# Altium project RASP-HDMI_MUX.PrjPcb
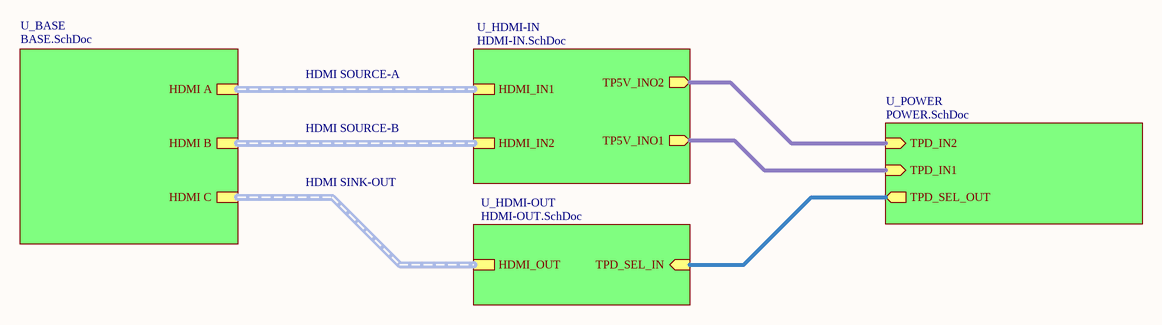
[diagram p0: MAIN.SchDoc]
CAGE_CODE: #; Date: 14.05.2022; DOC_NO_ASSY_DWG: #012022051430; DOC_NO_BOM: #012022051440; DOC_NO_FAB_DWG: #012022051420; DOC_NO_SCH_DWG: #012022051400; DocumentRevision: V1.2; PCB_DWG_NO: #012022051410; Project: HDMI-MUX; ProjectRevision: V1.0; Revision: V1.0
5 sheets, 70 parts. Net scope: hierarchical (ports join the sheet entries above them; power ports are global).
Board file: RASP.PcbDoc
Sheets:
  MAIN.SchDoc
    U_BASE = BASE.SchDoc
    U_HDMI-IN = HDMI-IN.SchDoc
    U_HDMI-OUT = HDMI-OUT.SchDoc
    U_POWER = POWER.SchDoc

## Sheet MAIN.SchDoc: MAIN BLOCK
size A4; Date: 14.06.2022; Revision: V1.0; SheetNumber: 1; SheetTotal: 5; ProjectRevision: V1.0; DOC_NO_SCH_DWG: #012022051400

### Sub-sheets
U_BASE = BASE.SchDoc: HDMI A (harness HDMI A), HDMI B (harness HDMI B), HDMI C (harness HDMI C)
U_HDMI-IN = HDMI-IN.SchDoc: HDMI_IN1 (harness HDMI_IN1), HDMI_IN2 (harness HDMI_IN2), TP5V_INO2 (out), TP5V_INO1 (out)
U_HDMI-OUT = HDMI-OUT.SchDoc: HDMI_OUT (harness HDMI_OUT), TPD_SEL_IN (in)
U_POWER = POWER.SchDoc: TPD_IN2 (in), TPD_IN1 (in), TPD_SEL_OUT (out)

### Nets
TP5V_IN1: sheet U_HDMI-IN/TP5V_INO1, sheet U_POWER/TPD_IN1
TP5V_IN2: sheet U_HDMI-IN/TP5V_INO2, sheet U_POWER/TPD_IN2
NetJH1C_3: sheet U_HDMI-OUT/TPD_SEL_IN, sheet U_POWER/TPD_SEL_OUT

### Buses and harness runs
harness sheet U_BASE/HDMI A = sheet U_HDMI-IN/HDMI_IN1
harness sheet U_BASE/HDMI B = sheet U_HDMI-IN/HDMI_IN2
harness sheet U_BASE/HDMI C = sheet U_HDMI-OUT/HDMI_OUT

### Notes on the sheet
- HDMI SOURCE-A
- HDMI SOURCE-B
- HDMI SINK-OUT
- THIS DOCUMENT AND THE DATA DISCLOSED HEREIN OR
- HEREWITH IS THE PROPERTY OF SPD Ind.
- ENG:
- DHARAGESWARAN S
- APPROVALS
- DATE
- PROJECT
- DSN:
- CHK:
- REFERENCE DOCUMENTS
- PROJECT REVISION:
- TITLE
- DOCUMENT REVISION:
- Email: sdhamuvkl@gmail.com <https://github.com/DhamuVkl>
- BOM:
- FAB DWG:
- PCB DWG:
- ASSY DWG:
- SCALE:
- A4
- SIZE
- CAGE CODE
- FILE NAME
- DWG NO.
- SHEET
- REV
- OF

## Sheet BASE.SchDoc: HDMI-MUX
size A4; SheetNumber: 2; SheetTotal: 5; DOC_NO_SCH_DWG: #012022051401
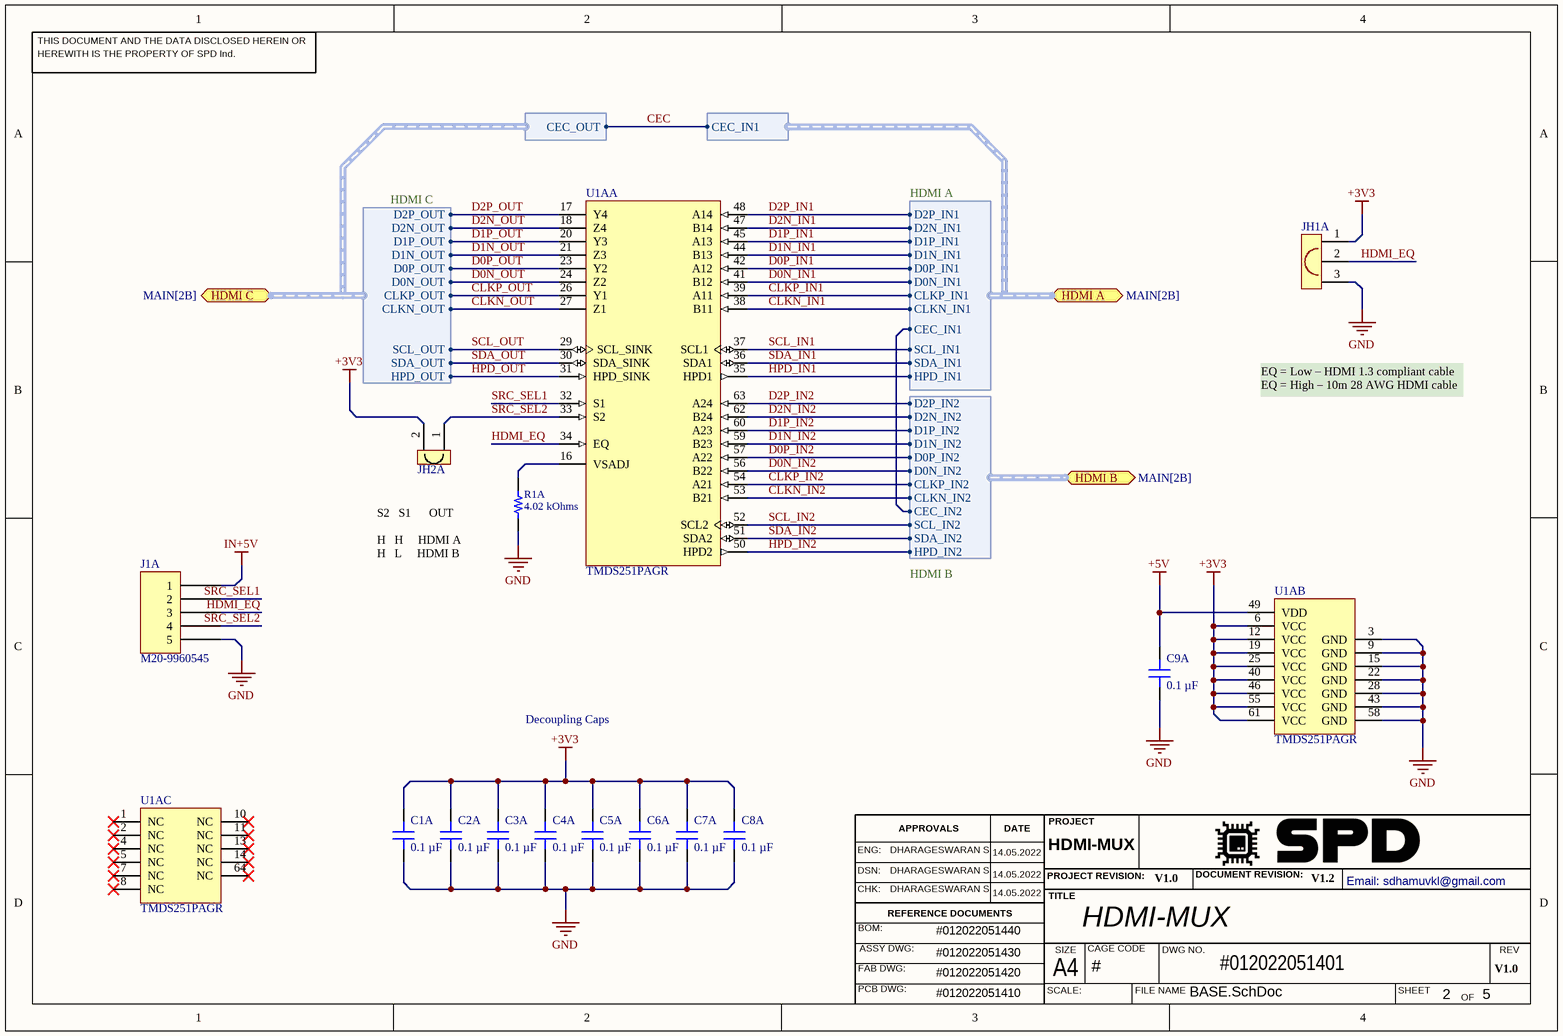
[diagram p1: BASE.SchDoc]

### Parts
C1A  0.1 µF  [CAP 0402_1005]
C2A  0.1 µF  [CAP 0402_1005]
C3A  0.1 µF  [CAP 0402_1005]
C4A  0.1 µF  [CAP 0402_1005]
C5A  0.1 µF  [CAP 0402_1005]
C6A  0.1 µF  [CAP 0402_1005]
C7A  0.1 µF  [CAP 0402_1005]
C8A  0.1 µF  [CAP 0402_1005]
C9A  0.1 µF  [CAP 0402_1005]
J1A  M20-9960545  [HARWIN M20-9960545]
JH1A  3PIN-JUMPER-RED  [JUMPER-3PIN-RED]  (value not drawn)
JH2A  2PIN-JUMPER-BLACK  [JUMPER-2PIN-BLACK]  (value not drawn)
R1A  4.02 kOhms  [RES 0402_1005]
U1A  TMDS251PAGR  [PAG0064A_L]  (parts A,B,C of 3)

### Ports
HDMI A (bidir, harness HDMI A, see MAIN[2B]), HDMI B (bidir, harness HDMI B, see MAIN[2B]), HDMI C (bidir, harness HDMI C, see MAIN[2B])

### Harnesses
HDMI A: D2P_IN1, D2N_IN1, D1P_IN1, D1N_IN1, D0P_IN1, D0N_IN1, CLKP_IN1, CLKN_IN1, SCL_IN1, SDA_IN1, HPD_IN1, CEC_IN1
HDMI B: D2P_IN2, D2N_IN2, D1P_IN2, D1N_IN2, D0P_IN2, D0N_IN2, CLKP_IN2, CLKN_IN2, SCL_IN2, SDA_IN2, HPD_IN2, CEC_IN2
HDMI C: D2P_OUT, D2N_OUT, D1P_OUT, D1N_OUT, D0P_OUT, D0N_OUT, CLKP_OUT, CLKN_OUT, SCL_OUT, SDA_OUT, HPD_OUT
HDMI C1: CEC_OUT
HDMI A1: CEC_IN1

### Nets
+3V3: C1A.2 C2A.2 C3A.2 C4A.2 C5A.2 C6A.2 C7A.2 C8A.2 JH1A.1 JH2A.2 U1A.6(VCC) U1A.12(VCC) U1A.19(VCC) U1A.25(VCC) U1A.40(VCC) U1A.46(VCC) U1A.55(VCC) U1A.61(VCC)
+5V: C9A.2 U1A.49(VDD)  [project net SOURCE]
GND: C1A.1 C2A.1 C3A.1 C4A.1 C5A.1 C6A.1 C7A.1 C8A.1 C9A.1 J1A.5 JH1A.3 R1A.1 U1A.3(GND) U1A.9(GND) U1A.15(GND) U1A.22(GND) U1A.28(GND) U1A.43(GND) U1A.58(GND)
IN+5V: J1A.1
CEC: port HDMI A.CEC_IN1, port HDMI B.CEC_IN2, port HDMI C.CEC_OUT
CLKN_IN1: U1A.38(B11) ; port HDMI A.CLKN_IN1  [project net CLK_IN1_N]
CLKN_IN2: U1A.53(B21) ; port HDMI B.CLKN_IN2  [project net CLK_IN2_N]
CLKN_OUT: U1A.27(Z1) ; port HDMI C.CLKN_OUT  [project net CLK_OUT_N]
CLKP_IN1: U1A.39(A11) ; port HDMI A.CLKP_IN1  [project net CLK_IN1_P]
CLKP_IN2: U1A.54(A21) ; port HDMI B.CLKP_IN2  [project net CLK_IN2_P]
CLKP_OUT: U1A.26(Y1) ; port HDMI C.CLKP_OUT  [project net CLK_OUT_P]
D0N_IN1: U1A.41(B12) ; port HDMI A.D0N_IN1  [project net D0_IN1_N]
D0N_IN2: U1A.56(B22) ; port HDMI B.D0N_IN2  [project net D0_IN2_N]
D0N_OUT: U1A.24(Z2) ; port HDMI C.D0N_OUT  [project net D0_OUT_N]
D0P_IN1: U1A.42(A12) ; port HDMI A.D0P_IN1  [project net D0_IN1_P]
D0P_IN2: U1A.57(A22) ; port HDMI B.D0P_IN2  [project net D0_IN2_P]
D0P_OUT: U1A.23(Y2) ; port HDMI C.D0P_OUT  [project net D0_OUT_P]
D1N_IN1: U1A.44(B13) ; port HDMI A.D1N_IN1  [project net D1_IN1_N]
D1N_IN2: U1A.59(B23) ; port HDMI B.D1N_IN2  [project net D1_IN2_N]
D1N_OUT: U1A.21(Z3) ; port HDMI C.D1N_OUT  [project net D1_OUT_N]
D1P_IN1: U1A.45(A13) ; port HDMI A.D1P_IN1  [project net D1_IN1_P]
D1P_IN2: U1A.60(A23) ; port HDMI B.D1P_IN2  [project net D1_IN2_P]
D1P_OUT: U1A.20(Y3) ; port HDMI C.D1P_OUT  [project net D1_OUT_P]
D2N_IN1: U1A.47(B14) ; port HDMI A.D2N_IN1  [project net D2_IN1_N]
D2N_IN2: U1A.62(B24) ; port HDMI B.D2N_IN2  [project net D2_IN2_N]
D2N_OUT: U1A.18(Z4) ; port HDMI C.D2N_OUT  [project net D2_OUT_N]
D2P_IN1: U1A.48(A14) ; port HDMI A.D2P_IN1  [project net D2_IN1_P]
D2P_IN2: U1A.63(A24) ; port HDMI B.D2P_IN2  [project net D2_IN2_P]
D2P_OUT: U1A.17(Y4) ; port HDMI C.D2P_OUT  [project net D2_OUT_P]
HDMI_EQ: J1A.3 JH1A.2 U1A.34(EQ)
HPD_IN1: U1A.35(HPD1) ; port HDMI A.HPD_IN1
HPD_IN2: U1A.50(HPD2) ; port HDMI B.HPD_IN2
HPD_OUT: U1A.31(HPD_SINK) ; port HDMI C.HPD_OUT
SCL_IN1: U1A.37(SCL1) ; port HDMI A.SCL_IN1
SCL_IN2: U1A.52(SCL2) ; port HDMI B.SCL_IN2
SCL_OUT: U1A.29(SCL_SINK) ; port HDMI C.SCL_OUT
SDA_IN1: U1A.36(SDA1) ; port HDMI A.SDA_IN1
SDA_IN2: U1A.51(SDA2) ; port HDMI B.SDA_IN2
SDA_OUT: U1A.30(SDA_SINK) ; port HDMI C.SDA_OUT
SRC_SEL1: J1A.2 U1A.32(S1)
SRC_SEL2: J1A.4 JH2A.1 U1A.33(S2)
NetR1A_2: R1A.2 U1A.16(VSADJ)

Not connected (* = marked no-connect by the designer): U1A 1(NC)* 2(NC)* 4(NC)* 5(NC)* 7(NC)* 8(NC)* 10(NC)* 11(NC)* 13(NC)* 14(NC)* 64(NC)*

### Notes on the sheet
- EQ = Low – HDMI 1.3 compliant cable
  EQ = High – 10m 28 AWG HDMI cable
- S2   S1      OUT
  H   H     HDMI A
  H   L     HDMI B
- Decoupling Caps
- THIS DOCUMENT AND THE DATA DISCLOSED HEREIN OR
- HEREWITH IS THE PROPERTY OF SPD Ind.
- ENG:
- DHARAGESWARAN S
- APPROVALS
- DATE
- PROJECT
- DSN:
- CHK:
- REFERENCE DOCUMENTS
- PROJECT REVISION:
- TITLE
- DOCUMENT REVISION:
- Email: sdhamuvkl@gmail.com <https://github.com/DhamuVkl>
- BOM:
- FAB DWG:
- PCB DWG:
- ASSY DWG:
- SCALE:
- A4
- SIZE
- CAGE CODE
- FILE NAME
- DWG NO.
- SHEET
- REV
- OF

### Library data of the parts
C1A C2A C3A C4A C5A C6A C7A C8A C9A = CL05B104KP5VPNC: CAP CER 100NF 10V X7R 0402; Manufacturer: Samsung Electro-Mechanics; id: 7736; Tolerance: ±10%; Part Number: CL05B104KP5VPNC; Value: 0.1 µF; Temperature Coefficient: X7R; Supplier Part Number 1: 1276-CL05B104KP5VPNCCT-ND; ComponentLink2Description: DigiKey Link; ComponentLink1URL: https://mm.digikey.com/Volume0/opasdata/d220001/medias/docus/5458/CL05B104KP5VPNC_Spec.pdf; PartId: 56690; Supplier 1: DigiKey; Series: CL; LastUpdated: 2023-11-05T20:02:55.743; Capacitance: 0.1 µF; Device Package: 0402 (1005 Metric); Ratings: AEC-Q200; Thickness (Max): 0.022" (0.55mm); Voltage - Rated: 10V; Minimum Order: 1; Packaging: TapeAndReel; Applications: Automotive; Package / Case: 0402 (1005 Metric); ComponentLink1Description: Datasheet; Price: 0.01; ComponentLink2URL: https://www.digikey.com/en/products/detail/samsung-electro-mechanics/CL05B104KP5VPNC/20498482; Lifecycle Status: Active; Operating Temperature: -55°C ~ 125°C; Size / Dimension: 0.039" L x 0.020" W (1.00mm x 0.50mm); Mounting Type: Surface Mount, MLCC
J1A = M20-9960545: CONN HEADER R/A 5POS 2.54MM; Manufacturer: Harwin Inc.; id: 168; Style: Board to Board or Cable; Current Rating (Amps): 3A per Contact; Contact Length - Mating: 0.240" (6.10mm); Connector Type: Header, Cuttable; Pitch - Mating: 0.100" (2.54mm); Number Of Positions: 5; Number Of Positions Loaded: All; Shrouding: Unshrouded; Material Flammability Rating: UL94 V-0; Row Spacing - Mating: -40°C ~ 105°C; Contact Length - Post: 0.118" (3.00mm); Part Number: M20-9960545; Supplier Part Number 1: 952-2246-ND; Contact Shape: Square; Termination: Solder; ComponentLink1Description: Datasheet; Contact Material: Brass; ComponentLink2URL: https://www.digikey.com/en/products/detail/harwin-inc/M20-9960545/3728210; Contact Finish - Mating: Gold; ComponentLink1URL: https://cdn.harwin.com/pdfs/Harwin_PC_Connectors_M20.pdf; Fastening Type: Push-Pull; Supplier 1: DigiKey; Number Of Rows: 1; Series: M20; Part Status: Active; ComponentLink2Description: DigiKey Link; Contact Type: Male Pin; Packaging: Bulk; Insulation Height: 0.100" (2.54mm); Minimum Order: 1; PartId: 168; Lifecycle Status: Active; LastUpdated: 2022-09-21T19:23:35.943; Operating Temperature: -40°C ~ 105°C; Insulation Color: Black; Mounting Type: Through Hole, Right Angle; Insulation Material: Polyamide (PA6T), Nylon 6T; Price: 0.14
R1A = CR0402-FX-4021GLF: RES SMD 4.02K OHM 1% 1/16W 0402; Manufacturer: Bourns Inc.; id: 2213; Temperature Coefficient: ±100ppm/°C; Power (Watts): 0.063W, 1/16W; Part Number: CR0402-FX-4021GLF; Height - Seated (Max): 0.016" (0.40mm); Supplier Part Number 1: CR0402-FX-4021GLFCT-ND; Supplier Device Package: 0402; ComponentLink1Description: Datasheet; ComponentLink2URL: https://www.digikey.com/en/products/detail/bourns-inc/CR0402-FX-4021GLF/3783361; ComponentLink1URL: https://www.bourns.com/docs/Product-Datasheets/CR0402.pdf; Composition: Thick Film; Tolerance: ±1%; Supplier 1: DigiKey; Series: CR0402; Part Status: Active; ComponentLink2Description: DigiKey Link; Device Package: 0402 (1005 Metric); Packaging: CutTape; Minimum Order: 1; Package / Case: 0402 (1005 Metric); PartId: 6644; Lifecycle Status: Active; LastUpdated: 2023-01-02T20:21:33.820; Operating Temperature: -55°C ~ 155°C; Number Of Terminations: 2; Value: 4.02 kOhms; Size / Dimension: 0.039" L x 0.020" W (1.00mm x 0.50mm); Price: 0.01; Resistance: 4.02 kOhms
U1A = CMP-0325-00084-3: 2.5 Gbps 2 to 1 DVI / HDMI Switch, 200 mA, 8 kV, 0 to +70 degC, 64-pin TQPF (PAG), Green (RoHS & no Sb/Br); Manufacturer: Texas Instruments; Data P-P Jitter(Max)(ps): 90; No. of TMDS Outputs: 1; No. of TMDS Inputs: 2; ESD HBM(kV): 8; TMDS Input Equalization: TRUE; Intra-Pair Skew(Max)(ps): 40; Inter-Pair Skew(Max)(ps): 65; Clock P-P Jitter(Max)(ps): 30; SubFamily: DVI/HDMI Repeater/Switch; ICC(Max)(mA): 200; PackageDescription: 64-Pin Thin Quad Flat Pack 0.5 mm Pitch; Eco-Plan: Green (RoHS & no Sb/Br); ComponentLink2Description: Datasheet; ComponentLink2URL: http://www.ti.com/general/docs/lit/getliterature.tsp?genericPartNumber=TMDS251&fileType=pdf; PackageReference: PAG0064A; DatasheetVersion: SLLS852A; PartNumber: TMDS251PAGR; ComponentLink1URL: http://www.ti.com/; ComponentLink1Description: Manufacturer URL; ComponentLink3URL: SamplesURL:http://www.ti.com/product/tmds251#samples; Mounting Technology: Surface Mount; ComponentLink3Description: URL Link1

## Sheet HDMI-IN.SchDoc: HDMI PORT-IN
size 193 x 292 mm; SheetNumber: 3; SheetTotal: 5; DOC_NO_SCH_DWG: #012022051402
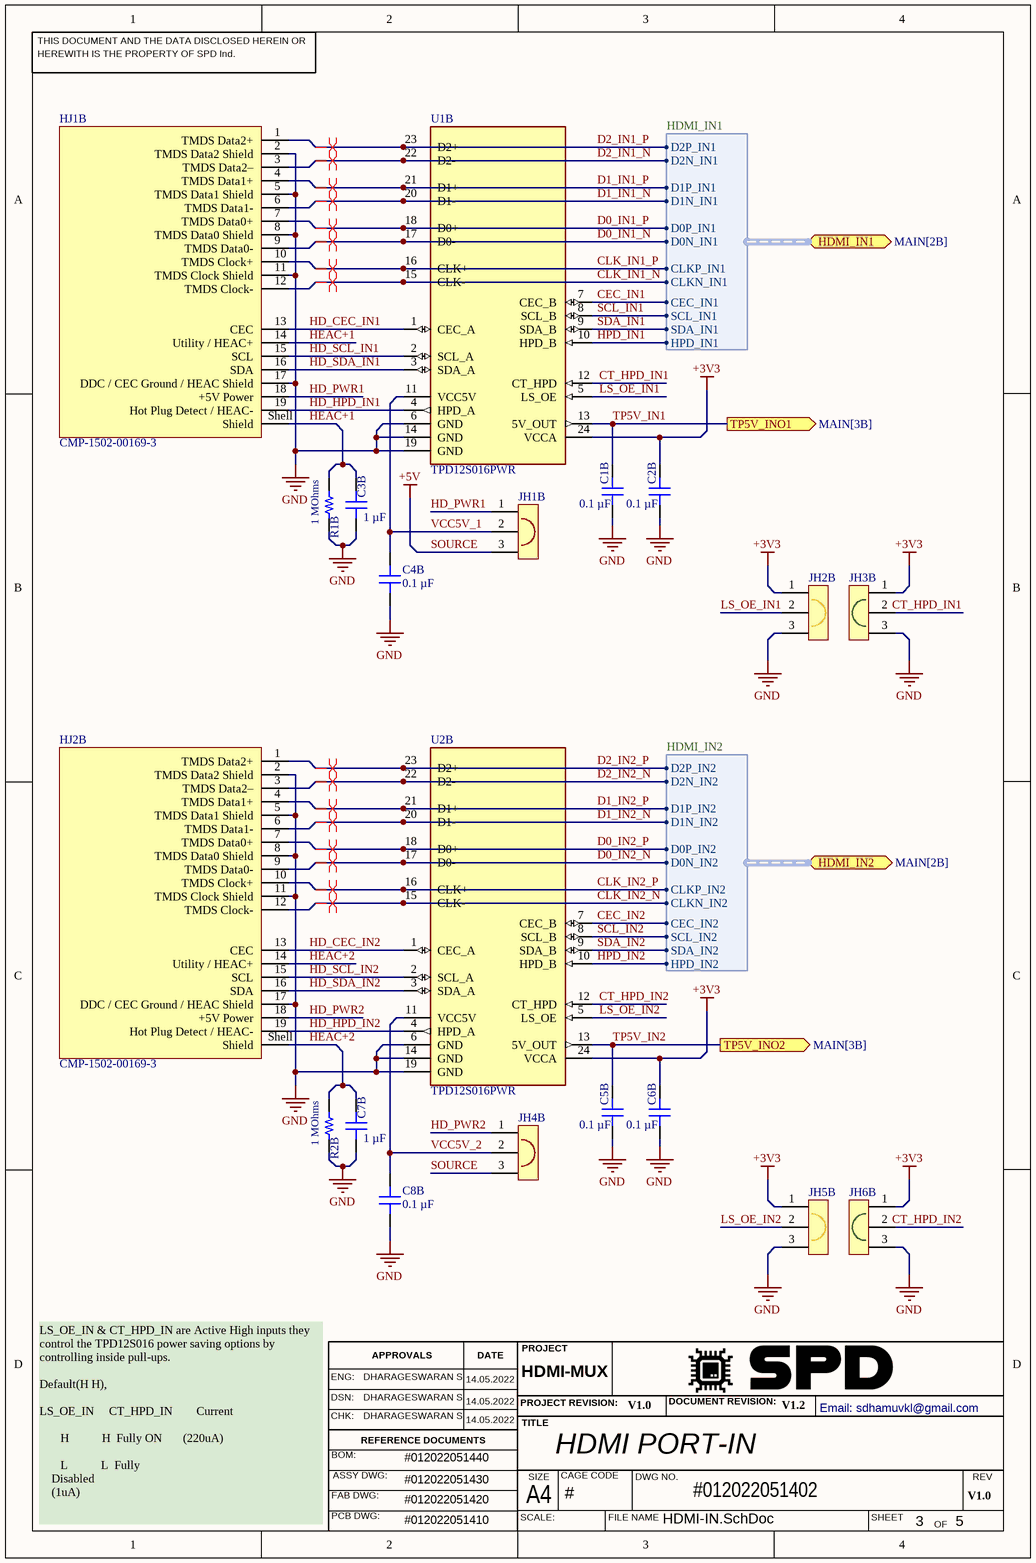
[diagram p2: HDMI-IN.SchDoc]

### Parts
C1B  0.1 µF  [CAP 0603_1608]
C2B  0.1 µF  [CAP 0603_1608]
C3B  1 µF  [CAP 0603_1608]
C4B  0.1 µF  [CAP 0603_1608]
C5B  0.1 µF  [CAP 0603_1608]
C6B  0.1 µF  [CAP 0603_1608]
C7B  1 µF  [CAP 0603_1608]
C8B  0.1 µF  [CAP 0603_1608]
HJ1B  CMP-1502-00169-3  [HDMI]
HJ2B  CMP-1502-00169-3  [HDMI]
JH1B  3PIN-JUMPER-RED  [JUMPER-3PIN-RED]  (value not drawn)
JH2B  3PIN-JUMPER-YELLOW  [JUMPER-3PIN-YELLOW]  (value not drawn)
JH3B  3PIN-JUMPER-GREEN  [JUMPER-3PIN-GREEN]  (value not drawn)
JH4B  3PIN-JUMPER-RED  [JUMPER-3PIN-RED]  (value not drawn)
JH5B  3PIN-JUMPER-YELLOW  [JUMPER-3PIN-YELLOW]  (value not drawn)
JH6B  3PIN-JUMPER-GREEN  [JUMPER-3PIN-GREEN]  (value not drawn)
R1B  1 MOhms  [RES 0603_1608]
R2B  1 MOhms  [RES 0603_1608]
U1B  TPD12S016PWR  [PW0024A_N]
U2B  TPD12S016PWR  [PW0024A_N]

### Ports
HDMI_IN1 (bidir, harness HDMI_IN1, see MAIN[2B]), HDMI_IN2 (bidir, harness HDMI_IN2, see MAIN[2B]), TP5V_INO1 (out, see MAIN[3B]), TP5V_INO2 (out, see MAIN[3B])

### Harnesses
HDMI_IN1: D2P_IN1, D2N_IN1, D1P_IN1, D1N_IN1, D0P_IN1, D0N_IN1, CLKP_IN1, CLKN_IN1, CEC_IN1, SCL_IN1, SDA_IN1, HPD_IN1
HDMI_IN2: D2P_IN2, D2N_IN2, D1P_IN2, D1N_IN2, D0P_IN2, D0N_IN2, CLKP_IN2, CLKN_IN2, CEC_IN2, SCL_IN2, SDA_IN2, HPD_IN2

### Nets
+3V3: C2B.2 C6B.2 JH2B.1 JH3B.1 JH5B.1 JH6B.1 U1B.24(VCCA) U2B.24(VCCA)
GND: C1B.1 C2B.1 C3B.1 C4B.1 C5B.1 C6B.1 C7B.1 C8B.1 HJ1B.2(TMDS_Data2_Shield) HJ1B.5(TMDS_Data1_Shield) HJ1B.8(TMDS_Data0_Shield) HJ1B.11(TMDS_Clock_Shield) HJ1B.17(DDC_/_CEC_Ground_/_HEAC_Shield) HJ2B.2(TMDS_Data2_Shield) HJ2B.5(TMDS_Data1_Shield) HJ2B.8(TMDS_Data0_Shield) HJ2B.11(TMDS_Clock_Shield) HJ2B.17(DDC_/_CEC_Ground_/_HEAC_Shield) JH2B.3 JH3B.3 JH5B.3 JH6B.3 R1B.1 R2B.1 U1B.6(GND) U1B.14(GND) U1B.19(GND) U2B.6(GND) U2B.14(GND) U2B.19(GND)
SOURCE: JH1B.3 JH4B.3  [also labelled +5V]
CEC_IN1: U1B.7(CEC_B) U2B.7(CEC_B) ; port HDMI_IN1.CEC_IN1, port HDMI_IN2.CEC_IN2  [also labelled CEC_IN2]  [project net CEC]
CLK_IN1_N: HJ1B.12(TMDS_Clock-) U1B.15(CLK-) ; port HDMI_IN1.CLKN_IN1
CLK_IN1_P: HJ1B.10(TMDS_Clock+) U1B.16(CLK+) ; port HDMI_IN1.CLKP_IN1
CLK_IN2_N: HJ2B.12(TMDS_Clock-) U2B.15(CLK-) ; port HDMI_IN2.CLKN_IN2
CLK_IN2_P: HJ2B.10(TMDS_Clock+) U2B.16(CLK+) ; port HDMI_IN2.CLKP_IN2
CT_HPD_IN1: JH3B.2 U1B.12(CT_HPD)
CT_HPD_IN2: JH6B.2 U2B.12(CT_HPD)
D0_IN1_N: HJ1B.9(TMDS_Data0-) U1B.17(D0-) ; port HDMI_IN1.D0N_IN1
D0_IN1_P: HJ1B.7(TMDS_Data0+) U1B.18(D0+) ; port HDMI_IN1.D0P_IN1
D0_IN2_N: HJ2B.9(TMDS_Data0-) U2B.17(D0-) ; port HDMI_IN2.D0N_IN2
D0_IN2_P: HJ2B.7(TMDS_Data0+) U2B.18(D0+) ; port HDMI_IN2.D0P_IN2
D1_IN1_N: HJ1B.6(TMDS_Data1-) U1B.20(D1-) ; port HDMI_IN1.D1N_IN1
D1_IN1_P: HJ1B.4(TMDS_Data1+) U1B.21(D1+) ; port HDMI_IN1.D1P_IN1
D1_IN2_N: HJ2B.6(TMDS_Data1-) U2B.20(D1-) ; port HDMI_IN2.D1N_IN2
D1_IN2_P: HJ2B.4(TMDS_Data1+) U2B.21(D1+) ; port HDMI_IN2.D1P_IN2
D2_IN1_N: HJ1B.3(TMDS_Data2–) U1B.22(D2-) ; port HDMI_IN1.D2N_IN1
D2_IN1_P: HJ1B.1(TMDS_Data2+) U1B.23(D2+) ; port HDMI_IN1.D2P_IN1
D2_IN2_N: HJ2B.3(TMDS_Data2–) U2B.22(D2-) ; port HDMI_IN2.D2N_IN2
D2_IN2_P: HJ2B.1(TMDS_Data2+) U2B.23(D2+) ; port HDMI_IN2.D2P_IN2
HD_CEC_IN1: HJ1B.13(CEC) U1B.1(CEC_A)
HD_CEC_IN2: HJ2B.13(CEC) U2B.1(CEC_A)
HD_HPD_IN1: HJ1B.19(Hot_Plug_Detect_/_HEAC-) U1B.4(HPD_A)
HD_HPD_IN2: HJ2B.19(Hot_Plug_Detect_/_HEAC-) U2B.4(HPD_A)
HD_PWR1: HJ1B.18(+5V_Power) JH1B.1
HD_PWR2: HJ2B.18(+5V_Power) JH4B.1
HD_SCL_IN1: HJ1B.15(SCL) U1B.2(SCL_A)
HD_SCL_IN2: HJ2B.15(SCL) U2B.2(SCL_A)
HD_SDA_IN1: HJ1B.16(SDA) U1B.3(SDA_A)
HD_SDA_IN2: HJ2B.16(SDA) U2B.3(SDA_A)
HEAC+1: C3B.2 HJ1B.14(Utility_/_HEAC+) HJ1B.Shell(Shield) R1B.2
HEAC+2: C7B.2 HJ2B.14(Utility_/_HEAC+) HJ2B.Shell(Shield) R2B.2
HPD_IN1: U1B.10(HPD_B) ; port HDMI_IN1.HPD_IN1
HPD_IN2: U2B.10(HPD_B) ; port HDMI_IN2.HPD_IN2
LS_OE_IN1: JH2B.2 U1B.5(LS_OE)
LS_OE_IN2: JH5B.2 U2B.5(LS_OE)
SCL_IN1: U1B.8(SCL_B) ; port HDMI_IN1.SCL_IN1
SCL_IN2: U2B.8(SCL_B) ; port HDMI_IN2.SCL_IN2
SDA_IN1: U1B.9(SDA_B) ; port HDMI_IN1.SDA_IN1
SDA_IN2: U2B.9(SDA_B) ; port HDMI_IN2.SDA_IN2
TP5V_IN1: C1B.2 U1B.13(5V_OUT) ; port TP5V_INO1
TP5V_IN2: C5B.2 U2B.13(5V_OUT) ; port TP5V_INO2
VCC5V_1: C4B.2 JH1B.2 U1B.11(VCC5V)
VCC5V_2: C8B.2 JH4B.2 U2B.11(VCC5V)

### Layout directives
differential pair: CLK_IN1_N, CLK_IN1_P, CLK_IN2_N, CLK_IN2_P, D0_IN1_N, D0_IN1_P, D0_IN2_N, D0_IN2_P, D1_IN1_N, D1_IN1_P, D1_IN2_N, D1_IN2_P, D2_IN1_N, D2_IN1_P, D2_IN2_N, D2_IN2_P

### Notes on the sheet
- LS_OE_IN & CT_HPD_IN are Active High inputs they control the TPD12S016 power saving options by controlling inside pull-ups.
  Default(H H),
  LS_OE_IN	    CT_HPD_IN        Current
  H		         H		Fully ON 						(220uA)
  L		         L		Fully
  Disabled
  (1uA)
- THIS DOCUMENT AND THE DATA DISCLOSED HEREIN OR
- HEREWITH IS THE PROPERTY OF SPD Ind.
- ENG:
- DHARAGESWARAN S
- APPROVALS
- DATE
- PROJECT
- DSN:
- CHK:
- REFERENCE DOCUMENTS
- PROJECT REVISION:
- TITLE
- DOCUMENT REVISION:
- Email: sdhamuvkl@gmail.com <https://github.com/DhamuVkl>
- BOM:
- FAB DWG:
- PCB DWG:
- ASSY DWG:
- SCALE:
- A4
- SIZE
- CAGE CODE
- FILE NAME
- DWG NO.
- SHEET
- REV
- OF

### Library data of the parts
C1B C2B C4B C5B C6B C8B = CC0603KRX7R6BB104: CAP CER 0.1UF 10V X7R 0603; Manufacturer: Yageo; id: 1361; Tolerance: ±10%; Part Number: CC0603KRX7R6BB104; Value: 0.1 µF; Temperature Coefficient: X7R; Supplier Part Number 1: 311-4055-1-ND; ComponentLink2Description: DigiKey Link; ComponentLink1URL: https://www.yageo.com/upload/media/product/productsearch/datasheet/mlcc/UPY-GPHC_X7R_6.3V-to-50V_18.pdf; PartId: 7937; Supplier 1: DigiKey; Series: CC; LastUpdated: 2023-01-03T20:07:31.763; Part Status: Active; Capacitance: 0.1 µF; Device Package: 0603 (1608 Metric); Thickness (Max): 0.035" (0.90mm); Voltage - Rated: 10V; Minimum Order: 1; Packaging: TapeAndReel; Applications: General Purpose; Package / Case: 0603 (1608 Metric); ComponentLink1Description: Datasheet; Price: 0.01; ComponentLink2URL: https://www.digikey.com/en/products/detail/yageo/CC0603KRX7R6BB104/5883741; Lifecycle Status: Active; Operating Temperature: -55°C ~ 125°C; Size / Dimension: 0.063" L x 0.031" W (1.60mm x 0.80mm); Mounting Type: Surface Mount, MLCC
C3B C7B = CC0603ZRY5V6BB105: CAP CER 1UF 10V Y5V 0603; Manufacturer: Yageo; id: 740; Temperature Coefficient: Y5V (F); Tolerance: -20%, +80%; Part Number: CC0603ZRY5V6BB105; Value: 1 µF; Supplier Part Number 1: 311-1357-1-ND; ComponentLink2Description: DigiKey Link; ComponentLink1URL: http://www.yageo.com/documents/recent/UPY-GPHC_Y5V_6.3V-to-50V_8.pdf; PartId: 5197; Supplier 1: DigiKey; Series: CC; LastUpdated: 2023-01-03T20:07:40.253; Part Status: Active; Capacitance: 1 µF; Device Package: 0603 (1608 Metric); Thickness (Max): 0.035" (0.90mm); Voltage - Rated: 10V; Minimum Order: 1; Packaging: TapeAndReel; Applications: General Purpose; Package / Case: 0603 (1608 Metric); ComponentLink1Description: Datasheet; Price: 0.01; ComponentLink2URL: https://www.digikey.com/en/products/detail/yageo/CC0603ZRY5V6BB105/2103095; Lifecycle Status: Active; Operating Temperature: -30°C ~ 85°C; Size / Dimension: 0.063" L x 0.031" W (1.60mm x 0.80mm); Mounting Type: Surface Mount, MLCC
R1B R2B = ERJ-U03J105V: RES 1 M OHM 5% 1/10W 0603 SMD; Manufacturer: Panasonic Electronic Components; id: 14889; Temperature Coefficient: -400/ +150ppm/°C; Power (Watts): 0.1W, 1/10W; Part Number: ERJ-U03J105V; Height - Seated (Max): 0.022" (0.55mm); Supplier Part Number 1: 10-ERJ-U03J105VCT-ND; Supplier Device Package: 0603; ComponentLink1Description: Datasheet; ComponentLink2URL: https://www.digikey.com/en/products/detail/panasonic-electronic-components/ERJ-U03J105V/11636001; Features: Anti-Sulfur, Automotive AEC-Q200; ComponentLink1URL: https://industrial.panasonic.com/cdbs/www-data/pdf/RDP0000/AOA0000C334.pdf; Composition: Thick Film; Tolerance: ±5%; Supplier 1: DigiKey; Series: ERJ-U03; Part Status: Active; ComponentLink2Description: DigiKey Link; Device Package: 0603 (1608 Metric); Packaging: TapeAndReel; Ratings: AEC-Q200; Minimum Order: 1; Package / Case: 0603 (1608 Metric); PartId: 63423; Lifecycle Status: Active; LastUpdated: 2023-01-02T20:28:16.920; Operating Temperature: -55°C ~ 155°C; Number Of Terminations: 2; Value: 1 MOhms; Size / Dimension: 0.063" L x 0.031" W (1.60mm x 0.80mm); Price: 0.01; Resistance: 1 MOhms
U1B U2B = CMP-0326-00070-3: Value-Line HDMI Companion Chip for Portable Applications, 12 Channels, -40 to +85 degC, 24-pin TSSOP (PW), Green (RoHS & no Sb/Br); Manufacturer: Texas Instruments; Differential Capacitance(pF): 0.05; IEC 61000-4-2 Contact(+/- kV): 8; SubFamily: ESD Solution; Breakdown Voltage(Min)(V): 9; IO Capacitance(Typ)(pF): 1; IO Leakage Current(nA): 1000; ComponentLink3Description: URL Link1; PackageReference: PW0024A; PackageDescription: 24-Pin Thin Small Outline Package 0.65 mm Pitch; PartNumber: TPD12S016PWR; ComponentLink3URL: SamplesURL:http://www.ti.com/product/tpd12s016#samples; ComponentLink2Description: Datasheet; ComponentLink2URL: http://www.ti.com/general/docs/lit/getliterature.tsp?genericPartNumber=TPD12S016&fileType=pdf; ComponentLink1Description: Manufacturer URL; ComponentLink1URL: http://www.ti.com/; Eco-Plan: Green (RoHS & no Sb/Br); Mounting Technology: Surface Mount; DatasheetVersion: SLLSE96A; PackageVersion: revG, Feb-2011
HJ1B HJ2B = CMP-1502-00169-3: Supplier 1: Mouser; Supplier Part Number 1: 538-208658-1051; Supplier 2: Mouser; Supplier Part Number 2: 710-685119134923

## Sheet HDMI-OUT.SchDoc: HDMI PORT-OUT
size A4; Revision: V1.0; SheetNumber: 4; SheetTotal: 5; DOC_NO_SCH_DWG: #012022051403
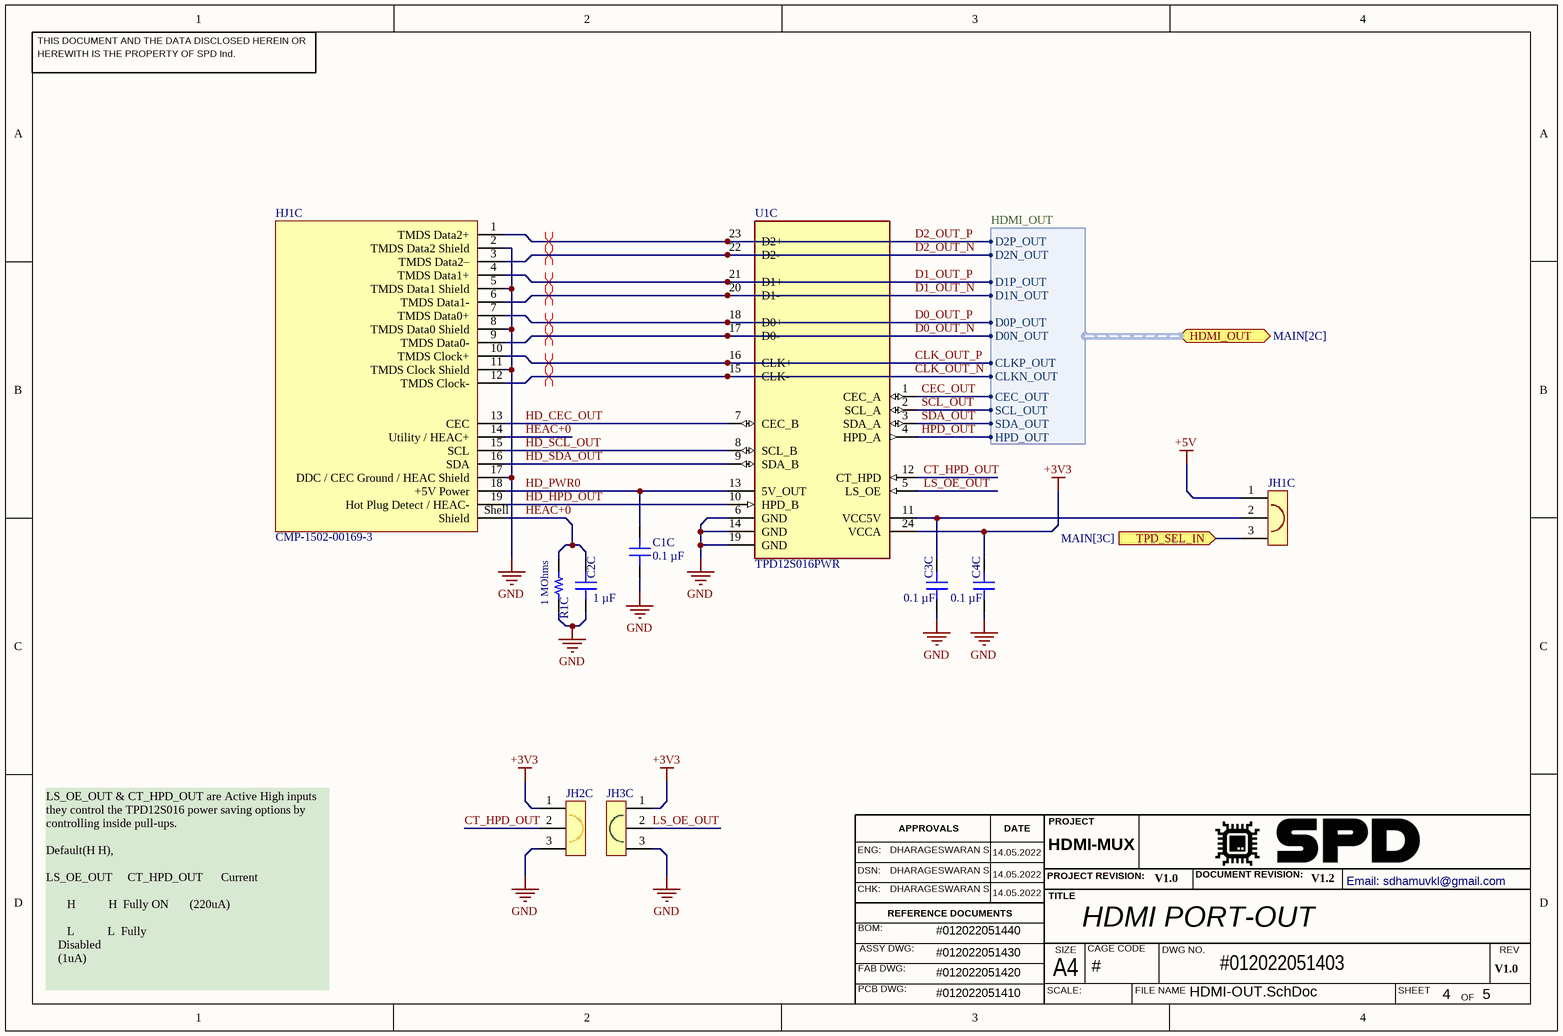
[diagram p3: HDMI-OUT.SchDoc]

### Parts
C1C  0.1 µF  [CAP 0603_1608]
C2C  1 µF  [CAP 0603_1608]
C3C  0.1 µF  [CAP 0603_1608]
C4C  0.1 µF  [CAP 0603_1608]
HJ1C  CMP-1502-00169-3  [HDMI]
JH1C  3PIN-JUMPER-RED  [JUMPER-3PIN-RED]  (value not drawn)
JH2C  3PIN-JUMPER-YELLOW  [JUMPER-3PIN-YELLOW]  (value not drawn)
JH3C  3PIN-JUMPER-GREEN  [JUMPER-3PIN-GREEN]  (value not drawn)
R1C  1 MOhms  [RES 0603_1608]
U1C  TPD12S016PWR  [PW0024A_N]

### Ports
HDMI_OUT (bidir, harness HDMI_OUT, see MAIN[2C]), TPD_SEL_IN (in, see MAIN[3C])

### Harnesses
HDMI_OUT: D2P_OUT, D2N_OUT, D1P_OUT, D1N_OUT, D0P_OUT, D0N_OUT, CLKP_OUT, CLKN_OUT, CEC_OUT, SCL_OUT, SDA_OUT, HPD_OUT

### Nets
+3V3: C4C.2 JH2C.1 JH3C.1 U1C.24(VCCA)
+5V: JH1C.1  [project net SOURCE]
GND: C1C.1 C2C.1 C3C.1 C4C.1 HJ1C.2(TMDS_Data2_Shield) HJ1C.5(TMDS_Data1_Shield) HJ1C.8(TMDS_Data0_Shield) HJ1C.11(TMDS_Clock_Shield) HJ1C.17(DDC_/_CEC_Ground_/_HEAC_Shield) JH2C.3 JH3C.3 R1C.1 U1C.6(GND) U1C.14(GND) U1C.19(GND)
CEC_OUT: U1C.1(CEC_A) ; port HDMI_OUT.CEC_OUT  [project net CEC]
CLK_OUT_N: HJ1C.12(TMDS_Clock-) U1C.15(CLK-) ; port HDMI_OUT.CLKN_OUT
CLK_OUT_P: HJ1C.10(TMDS_Clock+) U1C.16(CLK+) ; port HDMI_OUT.CLKP_OUT
CT_HPD_OUT: JH2C.2 U1C.12(CT_HPD)
D0_OUT_N: HJ1C.9(TMDS_Data0-) U1C.17(D0-) ; port HDMI_OUT.D0N_OUT
D0_OUT_P: HJ1C.7(TMDS_Data0+) U1C.18(D0+) ; port HDMI_OUT.D0P_OUT
D1_OUT_N: HJ1C.6(TMDS_Data1-) U1C.20(D1-) ; port HDMI_OUT.D1N_OUT
D1_OUT_P: HJ1C.4(TMDS_Data1+) U1C.21(D1+) ; port HDMI_OUT.D1P_OUT
D2_OUT_N: HJ1C.3(TMDS_Data2–) U1C.22(D2-) ; port HDMI_OUT.D2N_OUT
D2_OUT_P: HJ1C.1(TMDS_Data2+) U1C.23(D2+) ; port HDMI_OUT.D2P_OUT
HD_CEC_OUT: HJ1C.13(CEC) U1C.7(CEC_B)
HD_HPD_OUT: HJ1C.19(Hot_Plug_Detect_/_HEAC-) U1C.10(HPD_B)
HD_PWR0: C1C.2 HJ1C.18(+5V_Power) U1C.13(5V_OUT)
HD_SCL_OUT: HJ1C.15(SCL) U1C.8(SCL_B)
HD_SDA_OUT: HJ1C.16(SDA) U1C.9(SDA_B)
HEAC+0: C2C.2 HJ1C.14(Utility_/_HEAC+) HJ1C.Shell(Shield) R1C.2
HPD_OUT: U1C.4(HPD_A) ; port HDMI_OUT.HPD_OUT
LS_OE_OUT: JH3C.2 U1C.5(LS_OE)
SCL_OUT: U1C.2(SCL_A) ; port HDMI_OUT.SCL_OUT
SDA_OUT: U1C.3(SDA_A) ; port HDMI_OUT.SDA_OUT
NetC3C_2: C3C.2 JH1C.2 U1C.11(VCC5V)
NetJH1C_3: JH1C.3 ; port TPD_SEL_IN

### Layout directives
differential pair: CLK_OUT_N, CLK_OUT_P, D0_OUT_N, D0_OUT_P, D1_OUT_N, D1_OUT_P, D2_OUT_N, D2_OUT_P

### Notes on the sheet
- LS_OE_OUT & CT_HPD_OUT are Active High inputs they control the TPD12S016 power saving options by controlling inside pull-ups.
  Default(H H),
  LS_OE_OUT	    CT_HPD_OUT      Current
  H		         H		Fully ON 						(220uA)
  L		         L		Fully
  Disabled
  (1uA)
- THIS DOCUMENT AND THE DATA DISCLOSED HEREIN OR
- HEREWITH IS THE PROPERTY OF SPD Ind.
- ENG:
- DHARAGESWARAN S
- APPROVALS
- DATE
- PROJECT
- DSN:
- CHK:
- REFERENCE DOCUMENTS
- PROJECT REVISION:
- TITLE
- DOCUMENT REVISION:
- Email: sdhamuvkl@gmail.com <https://github.com/DhamuVkl>
- BOM:
- FAB DWG:
- PCB DWG:
- ASSY DWG:
- SCALE:
- A4
- SIZE
- CAGE CODE
- FILE NAME
- DWG NO.
- SHEET
- REV
- OF

### Library data of the parts
C1C C3C C4C = CC0603KRX7R6BB104: as C1B on sheet HDMI-IN; Part Number: CC0603KRX7R6BB104; Value: 0.1 µF; Temperature Coefficient: X7R; Supplier Part Number 1: 311-4055-1-ND; ComponentLink2Description: DigiKey Link; ComponentLink1URL: https://www.yageo.com/upload/media/product/productsearch/datasheet/mlcc/UPY-GPHC_X7R_6.3V-to-50V_18.pdf; PartId: 7937; Supplier 1: DigiKey; Series: CC; LastUpdated: 2023-01-03T20:07:31.763; Part Status: Active; Capacitance: 0.1 µF; Device Package: 0603 (1608 Metric); Thickness (Max): 0.035" (0.90mm); Voltage - Rated: 10V; Minimum Order: 1; Packaging: TapeAndReel; Applications: General Purpose; Package / Case: 0603 (1608 Metric); ComponentLink1Description: Datasheet; Price: 0.01; ComponentLink2URL: https://www.digikey.com/en/products/detail/yageo/CC0603KRX7R6BB104/5883741; Lifecycle Status: Active; Operating Temperature: -55°C ~ 125°C; Size / Dimension: 0.063" L x 0.031" W (1.60mm x 0.80mm); Mounting Type: Surface Mount, MLCC
C2C = CC0603ZRY5V6BB105: as C3B on sheet HDMI-IN; Part Number: CC0603ZRY5V6BB105; Value: 1 µF; Supplier Part Number 1: 311-1357-1-ND; ComponentLink2Description: DigiKey Link; ComponentLink1URL: http://www.yageo.com/documents/recent/UPY-GPHC_Y5V_6.3V-to-50V_8.pdf; PartId: 5197; Supplier 1: DigiKey; Series: CC; LastUpdated: 2023-01-03T20:07:40.253; Part Status: Active; Capacitance: 1 µF; Device Package: 0603 (1608 Metric); Thickness (Max): 0.035" (0.90mm); Voltage - Rated: 10V; Minimum Order: 1; Packaging: TapeAndReel; Applications: General Purpose; Package / Case: 0603 (1608 Metric); ComponentLink1Description: Datasheet; Price: 0.01; ComponentLink2URL: https://www.digikey.com/en/products/detail/yageo/CC0603ZRY5V6BB105/2103095; Lifecycle Status: Active; Operating Temperature: -30°C ~ 85°C; Size / Dimension: 0.063" L x 0.031" W (1.60mm x 0.80mm); Mounting Type: Surface Mount, MLCC
R1C = ERJ-U03J105V: as R1B on sheet HDMI-IN; Part Number: ERJ-U03J105V; Height - Seated (Max): 0.022" (0.55mm); Supplier Part Number 1: 10-ERJ-U03J105VCT-ND; Supplier Device Package: 0603; ComponentLink1Description: Datasheet; ComponentLink2URL: https://www.digikey.com/en/products/detail/panasonic-electronic-components/ERJ-U03J105V/11636001; Features: Anti-Sulfur, Automotive AEC-Q200; ComponentLink1URL: https://industrial.panasonic.com/cdbs/www-data/pdf/RDP0000/AOA0000C334.pdf; Composition: Thick Film; Tolerance: ±5%; Supplier 1: DigiKey; Series: ERJ-U03; Part Status: Active; ComponentLink2Description: DigiKey Link; Device Package: 0603 (1608 Metric); Packaging: TapeAndReel; Ratings: AEC-Q200; Minimum Order: 1; Package / Case: 0603 (1608 Metric); PartId: 63423; Lifecycle Status: Active; LastUpdated: 2023-01-02T20:28:16.920; Operating Temperature: -55°C ~ 155°C; Number Of Terminations: 2; Value: 1 MOhms; Size / Dimension: 0.063" L x 0.031" W (1.60mm x 0.80mm); Price: 0.01; Resistance: 1 MOhms
U1C = CMP-0326-00070-3: as U1B on sheet HDMI-IN; ComponentLink3Description: URL Link1; PackageReference: PW0024A; PackageDescription: 24-Pin Thin Small Outline Package 0.65 mm Pitch; PartNumber: TPD12S016PWR; ComponentLink3URL: SamplesURL:http://www.ti.com/product/tpd12s016#samples; ComponentLink2Description: Datasheet; ComponentLink2URL: http://www.ti.com/general/docs/lit/getliterature.tsp?genericPartNumber=TPD12S016&fileType=pdf; ComponentLink1Description: Manufacturer URL; ComponentLink1URL: http://www.ti.com/; Eco-Plan: Green (RoHS & no Sb/Br); Mounting Technology: Surface Mount; DatasheetVersion: SLLSE96A; PackageVersion: revG, Feb-2011
HJ1C = CMP-1502-00169-3: Supplier 1: Mouser; Supplier Part Number 1: 538-208658-1051; Supplier 2: Mouser; Supplier Part Number 2: 710-685119134923

## Sheet POWER.SchDoc: HDMI POWER
size A4; SheetNumber: 5; SheetTotal: 5; DOC_NO_SCH_DWG: #012022051404
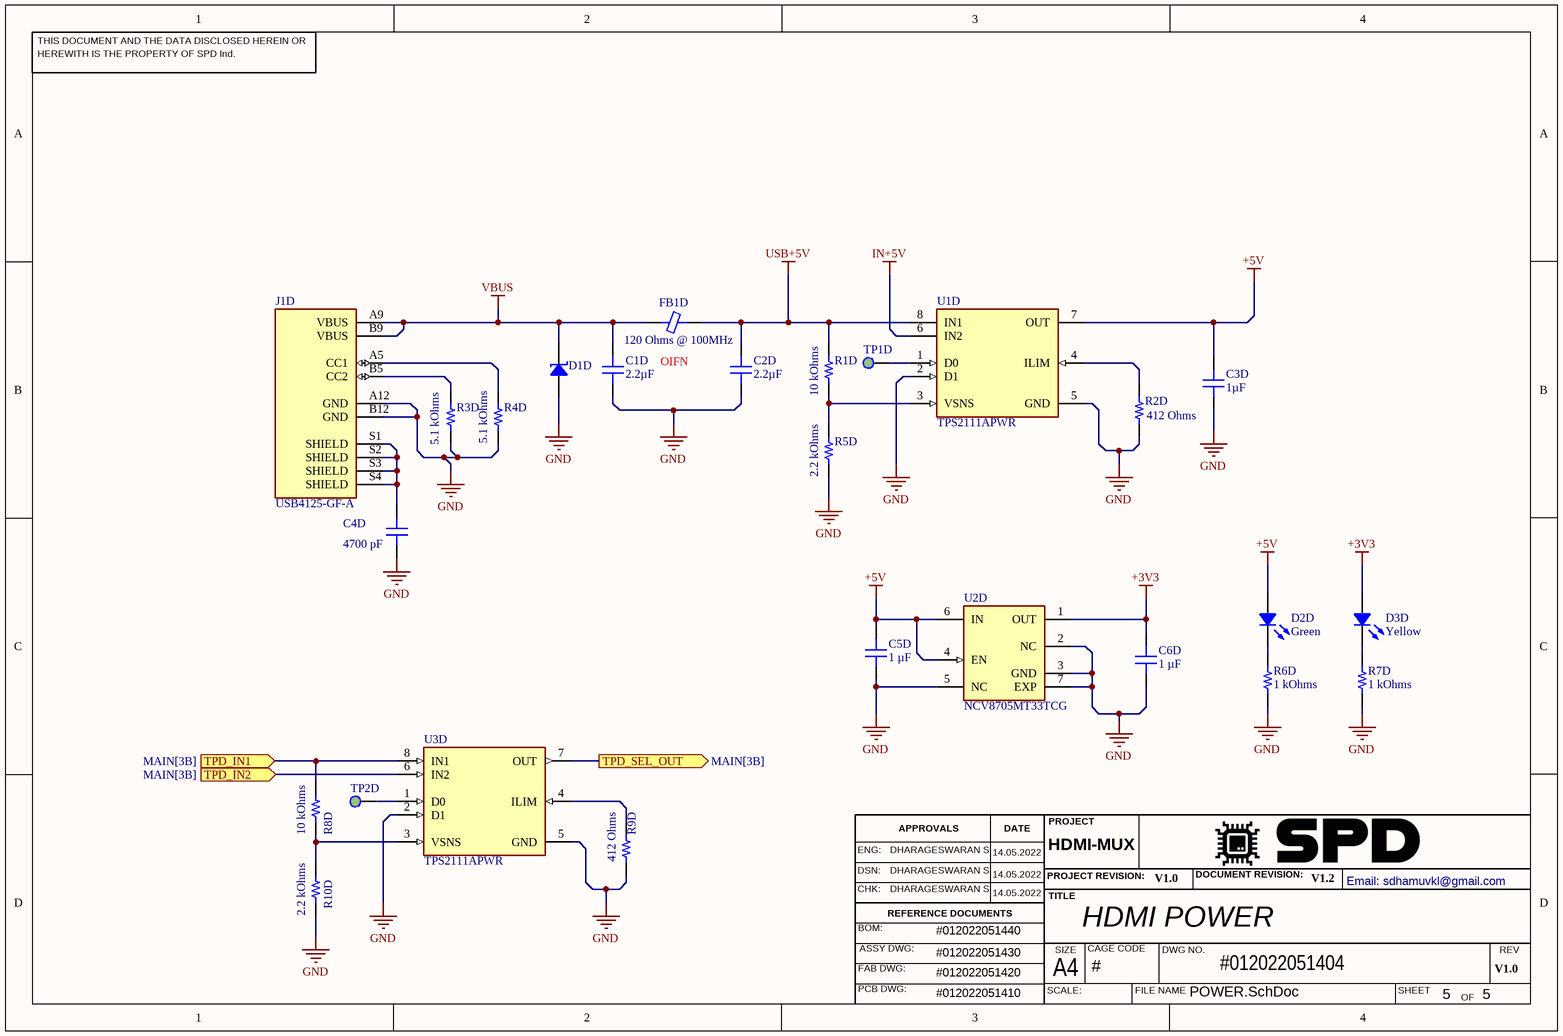
[diagram p4: POWER.SchDoc]

### Parts
C1D  2.2µF  [CAP 0402_1005]
C2D  2.2µF  [CAP 0402_1005]
C3D  1µF  [CAP 0603_1608]
C4D  4700 pF  [CAP 0402_1005]
C5D  1 µF  [CAP 0402_1005]
C6D  1 µF  [CAP 0402_1005]
D1D  VTVS5V0ASMF-M3-08  [SMF DO-219AB]  (value not drawn)
D2D  Green  [LED 0402_1005 GREEN]
D3D  Yellow  [LED 0402_1005 YELLOW]
FB1D  120 Ohms @ 100MHz  [FER 0201_0603]
J1D  USB4125-GF-A  [USB4125-GF-A]
R1D  10 kOhms  [RES 0402_1005]
R2D  412 Ohms  [RES 0402_1005]
R3D  5.1 kOhms  [RES 0402_1005]
R4D  5.1 kOhms  [RES 0402_1005]
R5D  2.2 kOhms  [RES 0402_1005]
R6D  1 kOhms  [RES 0402_1005]
R7D  1 kOhms  [RES 0402_1005]
R8D  10 kOhms  [RES 0402_1005]
R9D  412 Ohms  [RES 0402_1005]
R10D  2.2 kOhms  [RES 0402_1005]
TP1D  ROUND PAD 0.5MM  [ROUND PAD 0.5MM]  (value not drawn)
TP2D  ROUND PAD 0.5MM  [ROUND PAD 0.5MM]  (value not drawn)
U1D  TPS2111APWR  [FP-PW0008A-IPC_B]
U2D  NCV8705MT33TCG  [FP-511BR-MFG]
U3D  TPS2111APWR  [FP-PW0008A-IPC_B]

### Ports
TPD_IN1 (in, see MAIN[3B]), TPD_IN2 (in, see MAIN[3B]), TPD_SEL_OUT (out, see MAIN[3B])

### Nets
+3V3: C6D.2 D3D.1 U2D.1(OUT)
+5V: C3D.2 C5D.2 D2D.1 U1D.7(OUT) U2D.4(EN) U2D.6(IN)  [project net SOURCE]
GND: C1D.1 C2D.1 C3D.1 C4D.1 C5D.1 C6D.1 D1D.1 J1D.A12(GND) J1D.B12(GND) R2D.1 R3D.1 R4D.1 R5D.1 R6D.1 R7D.1 R9D.1 R10D.1 U1D.2(D1) U1D.5(GND) U2D.2(NC) U2D.3(GND) U2D.5(NC) U2D.7(EXP) U3D.2(D1) U3D.5(GND)
IN+5V: U1D.6(IN2)
USB+5V: C2D.2 FB1D.2 R1D.2 U1D.8(IN1)
VBUS: C1D.2 D1D.2 FB1D.1 J1D.A9(VBUS) J1D.B9(VBUS)
TP5V_IN1: R8D.2 U3D.8(IN1) ; port TPD_IN1
TP5V_IN2: U3D.6(IN2) ; port TPD_IN2
NetC4D_2: C4D.2 J1D.S1(SHIELD) J1D.S2(SHIELD) J1D.S3(SHIELD) J1D.S4(SHIELD)
NetD2D_2: D2D.2 R6D.2
NetD3D_2: D3D.2 R7D.2
NetJ1D_A5: J1D.A5(CC1) R4D.2
NetJ1D_B5: J1D.B5(CC2) R3D.2
NetJH1C_3: U3D.7(OUT) ; port TPD_SEL_OUT
NetR1D_1: R1D.1 R5D.2 U1D.3(VSNS)
NetR2D_2: R2D.2 U1D.4(ILIM)
NetR8D_1: R8D.1 R10D.2 U3D.3(VSNS)
NetR9D_2: R9D.2 U3D.4(ILIM)
NetTP1D_1: TP1D.1 U1D.1(D0)
NetTP2D_1: TP2D.1 U3D.1(D0)

### Notes on the sheet
- OIFN
- THIS DOCUMENT AND THE DATA DISCLOSED HEREIN OR
- HEREWITH IS THE PROPERTY OF SPD Ind.
- ENG:
- DHARAGESWARAN S
- APPROVALS
- DATE
- PROJECT
- DSN:
- CHK:
- REFERENCE DOCUMENTS
- PROJECT REVISION:
- TITLE
- DOCUMENT REVISION:
- Email: sdhamuvkl@gmail.com <https://github.com/DhamuVkl>
- BOM:
- FAB DWG:
- PCB DWG:
- ASSY DWG:
- SCALE:
- A4
- SIZE
- CAGE CODE
- FILE NAME
- DWG NO.
- SHEET
- REV
- OF

### Library data of the parts
C1D C2D = 0402ZD225KAT2A: CAP CER 2.2UF 10V X5R 0402; Manufacturer: AVX Corporation; id: 2335; Tolerance: ±10%; Part Number: 0402ZD225KAT2A; Value: 2.2µF; Temperature Coefficient: X5R; Supplier Part Number 1: 478-10072-1-ND; ComponentLink2Description: DigiKey Link; ComponentLink1URL: http://datasheets.avx.com/cx5r.pdf; PartId: 9346; Supplier 1: DigiKey; Series: -; LastUpdated: 2022-02-08T12:26:45.707; Part Status: Active; Capacitance: 2.2µF; Device Package: 0402 (1005 Metric); Thickness (Max): 0.022" (0.56mm); Voltage - Rated: 10V; Minimum Order: 1; Packaging: TapeAndReel; Applications: General Purpose; Package / Case: 0402 (1005 Metric); ComponentLink1Description: Datasheet; Price: 0.09; ComponentLink2URL: http://digikey.com/product-detail/en/avx-corporation/0402ZD225KAT2A/478-10072-1-ND/6564294; Lifecycle Status: Active; Operating Temperature: -55°C ~ 85°C; Size / Dimension: 0.039" L x 0.020" W (1.00mm x 0.50mm); Mounting Type: Surface Mount, MLCC
C3D = 06036D105KAT2A: CAP CER 1UF 6.3V X5R 0603; Manufacturer: AVX Corporation; id: 2190; Tolerance: ±10%; Part Number: 06036D105KAT2A; Value: 1µF; Temperature Coefficient: X5R; Supplier Part Number 1: 478-2581-1-ND; ComponentLink2Description: DigiKey Link; ComponentLink1URL: http://datasheets.avx.com/cx5r.pdf; PartId: 11585; Supplier 1: DigiKey; Series: -; LastUpdated: 2020-09-02T01:03:18.933; Part Status: Active; Capacitance: 1µF; Device Package: 0603 (1608 Metric); Thickness (Max): 0.035" (0.90mm); Voltage - Rated: 6.3V; Minimum Order: 1; Packaging: TapeAndReel; Applications: General Purpose; Package / Case: 0603 (1608 Metric); ComponentLink1Description: Datasheet; Price: 0.03; ComponentLink2URL: http://digikey.com/product-detail/en/avx-corporation/06036D105KAT2A/478-2581-1-ND/717526; Lifecycle Status: Active; Operating Temperature: -55°C ~ 85°C; Size / Dimension: 0.063" L x 0.032" W (1.60mm x 0.81mm); Mounting Type: Surface Mount, MLCC
C4D = C0402C472K4RECAUTO: CAP CER 0402 4.7NF 16V X7R 10%; Manufacturer: KEMET; id: 3032; Part Number: C0402C472K4RECAUTO; Value: 4700 pF; Temperature Coefficient: X7R; Supplier Part Number 1: 399-17875-1-ND; ComponentLink2Description: DigiKey Link; ComponentLink1URL: https://api.kemet.com/component-edge/download/datasheet/C0402C472K4RECAUTO.pdf; PartId: 12122; Tolerance: ±10%; Supplier 1: DigiKey; Series: ESD SMD Auto X7R; LastUpdated: 2023-01-03T20:03:46.940; Part Status: Active; Capacitance: 4700 pF; Device Package: 0402 (1005 Metric); Ratings: AEC-Q200; Thickness (Max): 0.022" (0.55mm); Voltage - Rated: 16V; Minimum Order: 1; Packaging: TapeAndReel; Applications: Automotive, ESD Protection; Package / Case: 0402 (1005 Metric); ComponentLink1Description: Datasheet; Price: 0.01; ComponentLink2URL: https://www.digikey.com/en/products/detail/kemet/C0402C472K4RECAUTO/8640469; Lifecycle Status: Active; Operating Temperature: -55°C ~ 125°C; Size / Dimension: 0.039" L x 0.020" W (1.00mm x 0.50mm); Mounting Type: Surface Mount, MLCC
C5D C6D = GRM155C81C105KE11D: CAP CER 1UF 16V X6S 0402; Manufacturer: Murata Electronics; id: 824; Tolerance: ±10%; Part Number: GRM155C81C105KE11D; Value: 1 µF; Temperature Coefficient: X6S; Supplier Part Number 1: 490-12700-1-ND; ComponentLink2Description: DigiKey Link; ComponentLink1URL: https://search.murata.co.jp/Ceramy/image/img/A01X/G101/ENG/GRM155C81C105KE11-01.pdf; PartId: 3683; Supplier 1: DigiKey; Series: GRM; LastUpdated: 2023-01-03T20:04:13.167; Part Status: Active; Capacitance: 1 µF; Device Package: 0402 (1005 Metric); Thickness (Max): 0.024" (0.60mm); Voltage - Rated: 16V; Minimum Order: 1; Packaging: TapeAndReel; Applications: General Purpose; Package / Case: 0402 (1005 Metric); ComponentLink1Description: Datasheet; Price: 0.01; ComponentLink2URL: https://www.digikey.com/en/products/detail/murata-electronics/GRM155C81C105KE11D/4905091; Lifecycle Status: Active; Operating Temperature: -55°C ~ 105°C; Size / Dimension: 0.039" L x 0.020" W (1.00mm x 0.50mm); Mounting Type: Surface Mount, MLCC
D1D = VTVS5V0ASMF-M3-08: TVS DIODE 5V 8.9V DO219AB; Manufacturer: Vishay Semiconductor Diodes Division; id: 18; Voltage - Breakdown (Min): 6.4V; Power Line Protection: No; Capacitance @ Frequency: 2095pF @ 1MHz; Type: Zener; Current - Peak Pulse (10/1000µs): 42.95A; Power - Peak Pulse: 400W; Unidirectional Channels: 1; Part Number: VTVS5V0ASMF-M3-08; Supplier Part Number 1: VTVS5V0ASMF-M3-08GICT-ND; Voltage - Reverse Standoff (Typ): 5V; Voltage - Clamping (Max) @ Ipp: 8.9V; Supplier Device Package: DO-219AB (SMF); ComponentLink1Description: Datasheet; ComponentLink2URL: http://digikey.com/product-detail/en/vishay-semiconductor-diodes-division/VTVS5V0ASMF-M3-08/VTVS5V0ASMF-M3-08GICT-ND/7056003; ComponentLink1URL: http://www.vishay.com/docs/85891/vtvs3v3asmf.pdf; Supplier 1: DigiKey; Series: TransZorb®; Part Status: Active; ComponentLink2Description: DigiKey Link; Packaging: TapeAndReel; Minimum Order: 1; Applications: General Purpose; Package / Case: DO-219AB; PartId: 5492; Lifecycle Status: Active; LastUpdated: 2023-01-02T21:08:29.887; Operating Temperature: -55°C ~ 175°C (TJ); Mounting Type: Surface Mount; Price: 0.11
D2D = HSMG-C280: LED GREEN DIFFUSED 0402 SMD; Manufacturer: Broadcom Limited; id: 697; Lens Color: White; Wavelength - Peak: 570nm; Lens Style: Rectangle with Flat Top; Viewing Angle: 130°; Lens Size: 1.00mm x 0.50mm; Configuration: Standard; Wavelength - Dominant: 572nm; Voltage - Forward (Vf) (Typ): 2.2V; Current - Test: 20mA; Millicandela Rating: 15mcd; Part Number: HSMG-C280; Supplier Part Number 1: 516-3066-1-ND; Lens Transparency: Diffused; Supplier Device Package: 0402; ComponentLink1Description: Datasheet; Color: Green; ComponentLink2URL: https://www.digikey.com/en/products/detail/broadcom-limited/HSMG-C280/1235358; ComponentLink1URL: https://docs.broadcom.com/docs/AV02-0602EN; Supplier 1: DigiKey; Series: -; Height (Max): 0.40mm; Part Status: Active; ComponentLink2Description: DigiKey Link; Device Package: 0402 (1005 Metric); Packaging: TapeAndReel; Minimum Order: 1; Package / Case: 0402 (1005 Metric); PartId: 697; Lifecycle Status: Active; LastUpdated: 2023-01-02T20:56:26.750; Value: Green; Size / Dimension: 1.00mm L x 0.50mm W; Mounting Type: Surface Mount; Price: 0.08
D3D = XZMYK68W-2: LED YELLOW CLEAR CHIP SMD; Manufacturer: SunLED; id: 167; Lens Color: Colorless; Wavelength - Peak: 590nm; Lens Style: Rectangle with Flat Top; Viewing Angle: 120°; Lens Size: 0.80mm x 0.50mm; Configuration: Standard; Voltage - Forward (Vf) (Typ): 2V; Current - Test: 20mA; Millicandela Rating: 148mcd; Part Number: XZMYK68W-2; Supplier Part Number 1: 1497-1198-1-ND; Lens Transparency: Clear; Supplier Device Package: Chip LED; ComponentLink1Description: Datasheet; Color: Yellow; ComponentLink2URL: https://www.digikey.com/en/products/detail/sunled/XZMYK68W-2/4745801; ComponentLink1URL: https://www.sunledusa.com/products/spec/XZMYK68W-2.pdf; Supplier 1: DigiKey; Series: -; Height (Max): 0.60mm; Part Status: Active; ComponentLink2Description: DigiKey Link; Device Package: 0402 (1005 Metric); Packaging: TapeAndReel; Minimum Order: 1; Package / Case: 0402 (1005 Metric); PartId: 167; Wavelength - Dominant: 590nm; Lifecycle Status: Active; LastUpdated: 2023-01-02T20:57:30.307; Value: Yellow; Size / Dimension: 1.00mm L x 0.50mm W; Mounting Type: Surface Mount; Price: 0.05
FB1D = BKP0603HM121-T: FERRITE BEAD 120 OHM 0201 1LN; Manufacturer: Taiyo Yuden; id: 127; DC Resistance (DCR) (Max): 180mOhm; Number Of Lines: 1; Filter Type: Power Line; Current Rating (Max): 800mA; Part Number: BKP0603HM121-T; Supplier Part Number 1: 587-3283-1-ND; ComponentLink1Description: Datasheet; ComponentLink2URL: http://digikey.com/product-detail/en/taiyo-yuden/BKP0603HM121-T/587-3283-1-ND/4157927; ComponentLink1URL: https://ds.yuden.co.jp/TYCOMPAS/ut/detail?pn=BKP0603HM121-T  &u=M; Supplier 1: DigiKey; Series: BK; Height (Max): 0.013" (0.33mm); Part Status: Active; ComponentLink2Description: DigiKey Link; Device Package: 0201 (0603 Metric); Impedance @ Frequency: 120 Ohms @ 100MHz; Packaging: TapeAndReel; Minimum Order: 1; Package / Case: 0201 (0603 Metric); PartId: 127; Lifecycle Status: Active; LastUpdated: 2023-01-02T20:50:51.660; Operating Temperature: -55°C ~ 85°C; Value: 120 Ohms @ 100MHz; Size / Dimension: 0.024" L x 0.012" W (0.60mm x 0.30mm); Mounting Type: Surface Mount; Price: 0.03
J1D = USB4125-GF-A: CONN RCPT TYPE C 6P SMD RA; Manufacturer: GCT; MP: USB4125-GF-A_REVA2; id: 21; Mating Cycles: 20000; Current Rating (Amps): 3A; Connector Type: USB-C (USB TYPE-C); Number Of Contacts: 24 (6+18 Dummy); Voltage - Rated: 20VDC; Shielding: Shielded; Number Of Ports: 1; Gender: Receptacle; Package: None; Availability: Unavailable; Value: *; Price: 0.67; Part Number: USB4125-GF-A; Supplier Part Number 1: 2073-USB4125-GF-ACT-ND; Specifications: -; Termination: Solder; ComponentLink1Description: Datasheets; ComponentLink6URL: https://gct.co/files/info/gct_certificate_of_compliance.pdf; ComponentLink2URL: https://mm.digikey.com/Volume0/opasdata/d220001/medias/docus/5561/USB4125 - Product Spec.pdf; Features: Power Only, No Data; Solder Retention Tab; ComponentLink1URL: https://mm.digikey.com/Volume0/opasdata/d220001/medias/docus/5407/gct-usb-type-c-product-selection-guide-2023-v1.5_web.pdf; Mounting Feature: Horizontal; Supplier 1: DigiKey; Series: USB4125; ComponentLink6Description: Environmental Information; Part Status: Active; ComponentLink5URL: https://www.digikey.com/api/videos/videoplayer/smallplayer/6247993315001; Ingress Protection: -; ComponentLink2Description: Datasheets; Device Package: Cut Tape (CT); Packaging: Cut Tape (CT); ComponentLink5Description: Video File; Minimum Order: 1; Lifecycle Status: Active; LastUpdated: 2023-10-13T19:13:52.5975723; ComponentLink4URL: https://mm.digikey.com/Volume0/opasdata/d220001/medias/images/2644/MFG_USB4125-GF-A.jpg; Operating Temperature: -30°C ~ 85°C; ComponentLink4Description: Product Photos; Mounting Type: Surface Mount, Right Angle; Through Hole; ComponentLink3Description: Datasheets; ComponentLink3URL: https://mm.digikey.com/Volume0/opasdata/d220001/medias/docus/5561/USB4125 - Product Drawing.pdf
R1D R8D = AA0402FR-0710KL: RES SMD 10K OHM 1% 1/16W 0402; Manufacturer: Yageo; id: 10610; Temperature Coefficient: ±150ppm/°C; Power (Watts): 0.063W, 1/16W; Part Number: AA0402FR-0710KL; Height - Seated (Max): 0.015" (0.37mm); Supplier Part Number 1: 13-AA0402FR-0710KLCT-ND; Supplier Device Package: 0402; ComponentLink1Description: Datasheet; ComponentLink2URL: https://www.digikey.com/en/products/detail/yageo/AA0402FR-0710KL/5887729; Features: Anti-Sulfur, Automotive AEC-Q200, Moisture Resistant; ComponentLink1URL: https://www.yageo.com/upload/media/product/productsearch/datasheet/rchip/PYu-AA_51_RoHS_L_3.pdf; Composition: Thick Film; Tolerance: ±1%; Supplier 1: DigiKey; Series: AA; Part Status: Active; ComponentLink2Description: DigiKey Link; Device Package: 0402 (1005 Metric); Packaging: TapeAndReel; Ratings: AEC-Q200; Minimum Order: 1; Package / Case: 0402 (1005 Metric); PartId: 59190; Lifecycle Status: Active; LastUpdated: 2023-01-02T20:20:10.303; Operating Temperature: -55°C ~ 155°C; Number Of Terminations: 2; Value: 10 kOhms; Size / Dimension: 0.039" L x 0.020" W (1.00mm x 0.50mm); Price: 0.01; Resistance: 10 kOhms
R2D R9D = CR0402-FX-4120GLF: RES SMD 412 OHM 1% 1/16W 0402; Manufacturer: Bourns Inc.; id: 6537; Temperature Coefficient: ±100ppm/°C; Power (Watts): 0.063W, 1/16W; Part Number: CR0402-FX-4120GLF; Height - Seated (Max): 0.016" (0.40mm); Supplier Part Number 1: CR0402-FX-4120GLFCT-ND; Supplier Device Package: 0402; ComponentLink1Description: Datasheet; ComponentLink2URL: https://www.digikey.com/en/products/detail/bourns-inc/CR0402-FX-4120GLF/3783365; ComponentLink1URL: https://www.bourns.com/docs/Product-Datasheets/CR0402.pdf; Composition: Thick Film; Tolerance: ±1%; Supplier 1: DigiKey; Series: CR0402; Part Status: Active; ComponentLink2Description: DigiKey Link; Device Package: 0402 (1005 Metric); Packaging: CutTape; Minimum Order: 1; Package / Case: 0402 (1005 Metric); PartId: 15070; Lifecycle Status: Active; LastUpdated: 2023-01-02T20:20:56.940; Operating Temperature: -55°C ~ 155°C; Number Of Terminations: 2; Value: 412 Ohms; Size / Dimension: 0.039" L x 0.020" W (1.00mm x 0.50mm); Price: 0.01; Resistance: 412 Ohms
R3D R4D = AC0402FR-075K1L: RES SMD 5.1K OHM 1% 1/16W 0402; Manufacturer: Yageo; id: 5028; Temperature Coefficient: ±100ppm/°C; Power (Watts): 0.063W, 1/16W; Part Number: AC0402FR-075K1L; Height - Seated (Max): 0.015" (0.37mm); Supplier Part Number 1: YAG3503CT-ND; Supplier Device Package: 0402; ComponentLink1Description: Datasheet; ComponentLink2URL: https://www.digikey.com/en/products/detail/yageo/AC0402FR-075K1L/5895438; Features: Automotive AEC-Q200, Moisture Resistant; ComponentLink1URL: https://www.yageo.com/upload/media/product/productsearch/datasheet/rchip/PYu-AC_51_RoHS_L_7.pdf; Composition: Thick Film; Tolerance: ±1%; Supplier 1: DigiKey; Series: AC; Part Status: Active; ComponentLink2Description: DigiKey Link; Device Package: 0402 (1005 Metric); Packaging: CutTape; Ratings: AEC-Q200; Minimum Order: 1; Package / Case: 0402 (1005 Metric); PartId: 12111; Lifecycle Status: Active; LastUpdated: 2023-01-02T20:21:09.567; Operating Temperature: -55°C ~ 155°C; Number Of Terminations: 2; Value: 5.1 kOhms; Size / Dimension: 0.039" L x 0.020" W (1.00mm x 0.50mm); Price: 0.01; Resistance: 5.1 kOhms
R5D R10D = AC0402JR-072K2L: RES SMD 2.2K OHM 5% 1/16W 0402; Manufacturer: Yageo; id: 7769; Temperature Coefficient: ±100ppm/°C; Power (Watts): 0.063W, 1/16W; Part Number: AC0402JR-072K2L; Height - Seated (Max): 0.015" (0.37mm); Supplier Part Number 1: YAG3536CT-ND; Supplier Device Package: 0402; ComponentLink1Description: Datasheet; ComponentLink2URL: https://www.digikey.com/en/products/detail/yageo/AC0402JR-072K2L/5895634; Features: Automotive AEC-Q200, Moisture Resistant; ComponentLink1URL: https://www.yageo.com/upload/media/product/productsearch/datasheet/rchip/PYu-AC_51_RoHS_L_7.pdf; Composition: Thick Film; Tolerance: ±5%; Supplier 1: DigiKey; Series: AC; Part Status: Active; ComponentLink2Description: DigiKey Link; Device Package: 0402 (1005 Metric); Packaging: CutTape; Ratings: AEC-Q200; Minimum Order: 1; Package / Case: 0402 (1005 Metric); PartId: 17508; Lifecycle Status: Active; LastUpdated: 2023-01-02T20:20:46.197; Operating Temperature: -55°C ~ 155°C; Number Of Terminations: 2; Value: 2.2 kOhms; Size / Dimension: 0.039" L x 0.020" W (1.00mm x 0.50mm); Price: 0.01; Resistance: 2.2 kOhms
R6D R7D = AA0402FR-071KL: RES SMD 1K OHM 1% 1/16W 0402; Manufacturer: Yageo; id: 10598; Temperature Coefficient: ±150ppm/°C; Power (Watts): 0.063W, 1/16W; Part Number: AA0402FR-071KL; Height - Seated (Max): 0.015" (0.37mm); Supplier Part Number 1: 13-AA0402FR-071KLCT-ND; Supplier Device Package: 0402; ComponentLink1Description: Datasheet; ComponentLink2URL: https://www.digikey.com/en/products/detail/yageo/AA0402FR-071KL/5887878; Features: Anti-Sulfur, Automotive AEC-Q200, Moisture Resistant; ComponentLink1URL: https://www.yageo.com/upload/media/product/productsearch/datasheet/rchip/PYu-AA_51_RoHS_L_3.pdf; Composition: Thick Film; Tolerance: ±1%; Supplier 1: DigiKey; Series: AA; Part Status: Active; ComponentLink2Description: DigiKey Link; Device Package: 0402 (1005 Metric); Packaging: TapeAndReel; Ratings: AEC-Q200; Minimum Order: 1; Package / Case: 0402 (1005 Metric); PartId: 59178; Lifecycle Status: Active; LastUpdated: 2023-01-02T20:20:10.210; Operating Temperature: -55°C ~ 155°C; Number Of Terminations: 2; Value: 1 kOhms; Size / Dimension: 0.039" L x 0.020" W (1.00mm x 0.50mm); Price: 0.01; Resistance: 1 kOhms
U1D U3D = CMP-0339-00036-3: IC OR CTRLR SRC SELECT 8TSSOP; Turn-Off Delay Time: 5ms; Number of Outputs: 1; Turn-On Delay Time: 1ms; Operating Supply Current: 55uA; On-State Resistance: 84mR; Current - Output 2: 1.25A; Operating Supply Voltage: 5.5V; Max Power Dissipation: 387mW; Min Input Voltage: 2.8V; Number of Circuits: 2; Output Voltage: 6V; Number of Pins: 8; REACH SVHC: No SVHC; Package Quantity: 1; Max Operating Temperature: 85°C; Nominal Supply Current: 55uA; Packaging: Tape and Reel; Min Operating Temperature: -40°C; Output Current: 1.25A; Lead Free: Lead Free; Max Output Current: 1.25A; Max Input Voltage: 5.5V; Case/Package: TSSOP; Radiation Hardening: No; Number of Inputs: 2; Weight: 0.001376oz
U2D = CMP-07128-000006-2: IC REG LINEAR 3.3V 500MA 6WDFN; Number of Outputs: 1; Min Input Voltage: 2.5V; Accuracy: 2%; Min Current Limit: 510mA; Polarity: Positive; Output Type: Fixed; Quiescent Current: 25uA; Dropout Voltage: 230mV; Max Input Voltage: 5.5V; Number of Pins: 6; Mount: Surface Mount; Package Quantity: 3000; Lead Free: Lead Free; Radiation Hardening: No; Min Operating Temperature: -40°C; Number of Regulators: 1; Max Operating Temperature: 125°C; Output Current: 500mA; Max Output Current: 500mA; Packaging: Tape and Reel; Output Voltage: 3.3V

## Nets that join several sheets
+3V3: BASE (18 pins), HDMI-IN (8 pins), HDMI-OUT (C4C.2 JH2C.1 JH3C.1 U1C.24), POWER (C6D.2 D3D.1 U2D.1)
GND: BASE (19 pins), HDMI-IN (30 pins), HDMI-OUT (15 pins), POWER (25 pins)
IN+5V: BASE (J1A.1), POWER (U1D.6)
SOURCE: BASE (C9A.2 U1A.49), HDMI-IN (JH1B.3 JH4B.3), HDMI-OUT (JH1C.1), POWER (6 pins)
CEC: HDMI-IN (U1B.7 U2B.7), HDMI-OUT (U1C.1)
CLK_IN1_N: BASE (U1A.38), HDMI-IN (HJ1B.12 U1B.15)
CLK_IN1_P: BASE (U1A.39), HDMI-IN (HJ1B.10 U1B.16)
CLK_IN2_N: BASE (U1A.53), HDMI-IN (HJ2B.12 U2B.15)
CLK_IN2_P: BASE (U1A.54), HDMI-IN (HJ2B.10 U2B.16)
CLK_OUT_N: BASE (U1A.27), HDMI-OUT (HJ1C.12 U1C.15)
CLK_OUT_P: BASE (U1A.26), HDMI-OUT (HJ1C.10 U1C.16)
D0_IN1_N: BASE (U1A.41), HDMI-IN (HJ1B.9 U1B.17)
D0_IN1_P: BASE (U1A.42), HDMI-IN (HJ1B.7 U1B.18)
D0_IN2_N: BASE (U1A.56), HDMI-IN (HJ2B.9 U2B.17)
D0_IN2_P: BASE (U1A.57), HDMI-IN (HJ2B.7 U2B.18)
D0_OUT_N: BASE (U1A.24), HDMI-OUT (HJ1C.9 U1C.17)
D0_OUT_P: BASE (U1A.23), HDMI-OUT (HJ1C.7 U1C.18)
D1_IN1_N: BASE (U1A.44), HDMI-IN (HJ1B.6 U1B.20)
D1_IN1_P: BASE (U1A.45), HDMI-IN (HJ1B.4 U1B.21)
D1_IN2_N: BASE (U1A.59), HDMI-IN (HJ2B.6 U2B.20)
D1_IN2_P: BASE (U1A.60), HDMI-IN (HJ2B.4 U2B.21)
D1_OUT_N: BASE (U1A.21), HDMI-OUT (HJ1C.6 U1C.20)
D1_OUT_P: BASE (U1A.20), HDMI-OUT (HJ1C.4 U1C.21)
D2_IN1_N: BASE (U1A.47), HDMI-IN (HJ1B.3 U1B.22)
D2_IN1_P: BASE (U1A.48), HDMI-IN (HJ1B.1 U1B.23)
D2_IN2_N: BASE (U1A.62), HDMI-IN (HJ2B.3 U2B.22)
D2_IN2_P: BASE (U1A.63), HDMI-IN (HJ2B.1 U2B.23)
D2_OUT_N: BASE (U1A.18), HDMI-OUT (HJ1C.3 U1C.22)
D2_OUT_P: BASE (U1A.17), HDMI-OUT (HJ1C.1 U1C.23)
HPD_IN1: BASE (U1A.35), HDMI-IN (U1B.10)
HPD_IN2: BASE (U1A.50), HDMI-IN (U2B.10)
HPD_OUT: BASE (U1A.31), HDMI-OUT (U1C.4)
NetJH1C_3: HDMI-OUT (JH1C.3), POWER (U3D.7)
SCL_IN1: BASE (U1A.37), HDMI-IN (U1B.8)
SCL_IN2: BASE (U1A.52), HDMI-IN (U2B.8)
SCL_OUT: BASE (U1A.29), HDMI-OUT (U1C.2)
SDA_IN1: BASE (U1A.36), HDMI-IN (U1B.9)
SDA_IN2: BASE (U1A.51), HDMI-IN (U2B.9)
SDA_OUT: BASE (U1A.30), HDMI-OUT (U1C.3)
TP5V_IN1: HDMI-IN (C1B.2 U1B.13), POWER (R8D.2 U3D.8)
TP5V_IN2: HDMI-IN (C5B.2 U2B.13), POWER (U3D.6)